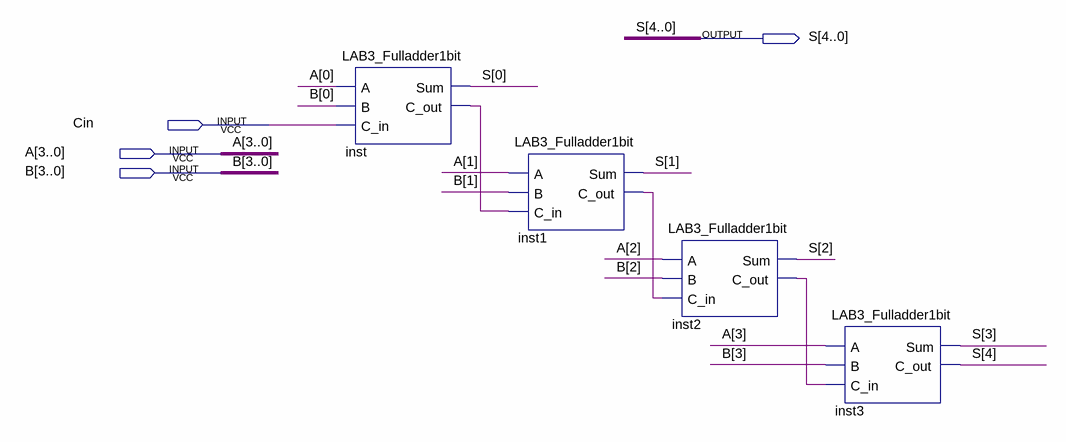
[diagram p0: schematic sheet]
// Quartus schematic Adder_4bit.bdf as structural Verilog: 4 symbols, 4 pins
module Adder_4bit (
  input  Cin,
  input  [3:0] A,
  input  [3:0] B,
  output [4:0] S
);

  wire inst1_c_out, inst2_c_out, inst_c_out;

  LAB3_Fulladder1bit inst (.A(A[0]), .B(B[0]), .C_in(Cin), .Sum(S[0]), .C_out(inst_c_out));
  LAB3_Fulladder1bit inst1 (.A(A[1]), .B(B[1]), .C_in(inst_c_out), .Sum(S[1]), .C_out(inst1_c_out));
  LAB3_Fulladder1bit inst2 (.A(A[2]), .B(B[2]), .C_in(inst1_c_out), .Sum(S[2]), .C_out(inst2_c_out));
  LAB3_Fulladder1bit inst3 (.A(A[3]), .B(B[3]), .C_in(inst2_c_out), .Sum(S[3]), .C_out(S[4]));
endmodule
